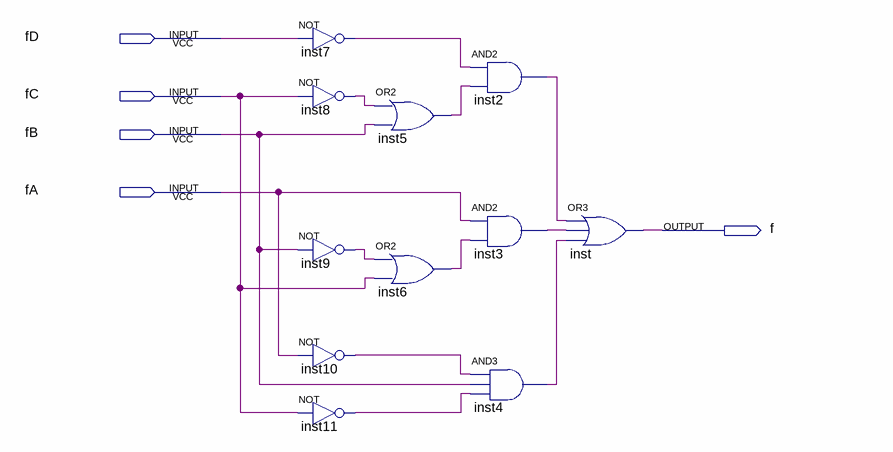
[diagram p0: schematic sheet]
// Quartus schematic segmentoF.bdf as structural Verilog: 11 symbols, 5 pins
module segmentoF (
  input  fD,
  input  fC,
  input  fB,
  input  fA,
  output f
);

  wire inst2_out, inst3_out, inst4_out, inst5_out, inst6_out, inst7_out, inst8_out, inst9_out, inst10_out,
       inst11_out;

  not inst7 (inst7_out, fD);
  not inst8 (inst8_out, fC);
  not inst9 (inst9_out, fB);
  not inst10 (inst10_out, fA);
  not inst11 (inst11_out, fC);
  or inst5 (inst5_out, inst8_out, fB);
  or inst6 (inst6_out, inst9_out, fC);
  and inst2 (inst2_out, inst7_out, inst5_out);
  and inst3 (inst3_out, fA, inst6_out);
  and inst4 (inst4_out, inst10_out, fB, inst11_out);
  or inst (f, inst2_out, inst3_out, inst4_out);
endmodule
